# EAGLE schematic untitled (EAGLE 5.11)
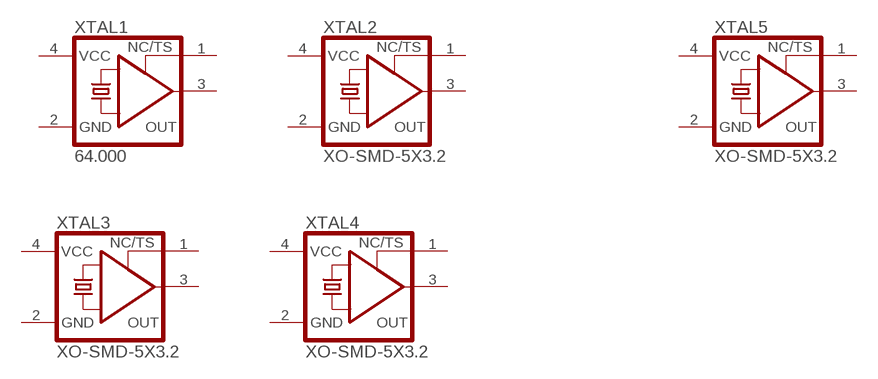
[diagram p0: schematic, sheet 1]

## Parts
XTAL1  64.000  XO-SMD-5X3.2  [CRYSTAL-SMD-5X3.2MM]
XTAL2  XO-SMD-5X3.2  [CRYSTAL-SMD-5X3.2MM]
XTAL3  XO-SMD-5X3.2  [CRYSTAL-SMD-5X3.2MM]
XTAL4  XO-SMD-5X3.2  [CRYSTAL-SMD-5X3.2MM]
XTAL5  XO-SMD-5X3.2  [CRYSTAL-SMD-5X3.2MM]
Unconnected: XTAL1.1(TS) XTAL1.3(OUT) XTAL2.1(TS) XTAL2.3(OUT) XTAL3.1(TS) XTAL3.3(OUT) XTAL4.1(TS) XTAL4.3(OUT) XTAL5.1(TS) XTAL5.3(OUT)

## Power pins joined to a net without a drawn wire
GND: XTAL1.2(GND) XTAL2.2(GND) XTAL3.2(GND) XTAL4.2(GND) XTAL5.2(GND)
VCC: XTAL1.4(VCC) XTAL2.4(VCC) XTAL3.4(VCC) XTAL4.4(VCC) XTAL5.4(VCC)

## Library data of the parts
XTAL1-XTAL5 = alexios:XO-: Crystal Oscillator for DIP sockets Crystal oscillators in DIP8 or DIP14 packages with sockets. Drills extra holes on the PCB to allow a standard DIP8 or DIP14 socket to be installed.